# Altium schematic sheet SD & Boot.SchDoc
size A3; SheetNumber: 4; SheetTotal: 11
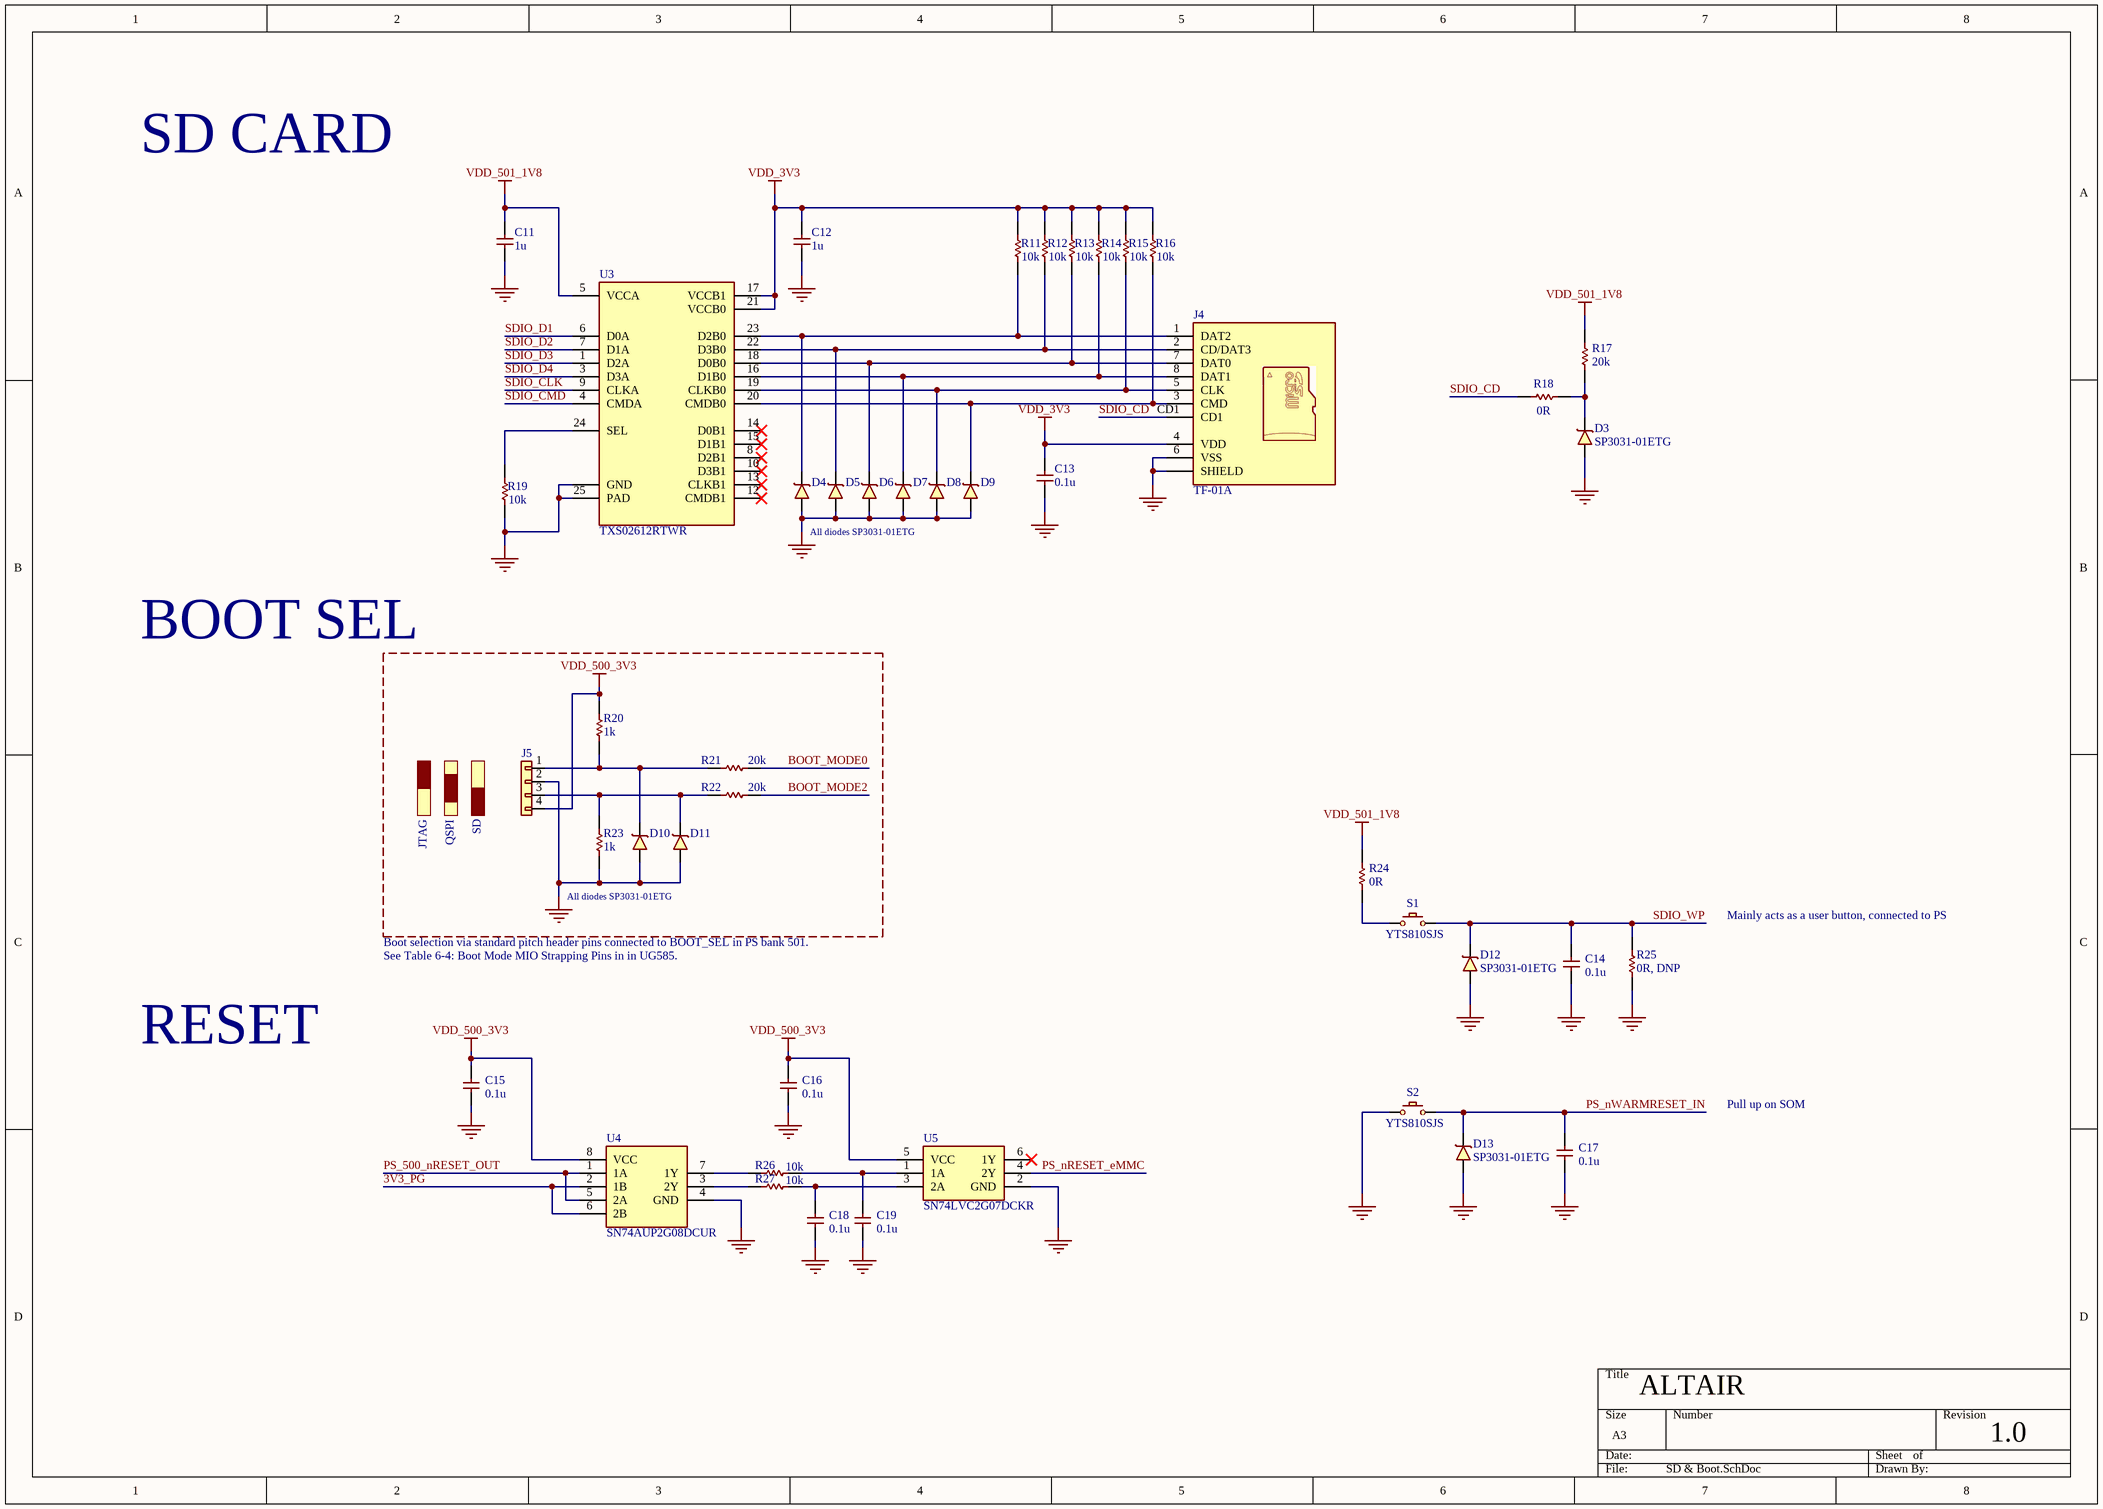
[diagram p0: SD & Boot.SchDoc]

## Parts
C11  1u  [CAP_0402]
C12  1u  [CAP_0402]
C13  0.1u  [CAP_0402]
C14  0.1u  [CAP_0402]
C15  0.1u  [CAP_0402]
C16  0.1u  [CAP_0402]
C17  0.1u  [CAP_0402]
C18  0.1u  [CAP_0402]
C19  0.1u  [CAP_0402]
D3  SP3031-01ETG  [SP303101ETG]
D4  SP3031-01ETG  [SP303101ETG]  (value not drawn)
D5  SP3031-01ETG  [SP303101ETG]  (value not drawn)
D6  SP3031-01ETG  [SP303101ETG]  (value not drawn)
D7  SP3031-01ETG  [SP303101ETG]  (value not drawn)
D8  SP3031-01ETG  [SP303101ETG]  (value not drawn)
D9  SP3031-01ETG  [SP303101ETG]  (value not drawn)
D10  SP3031-01ETG  [SP303101ETG]  (value not drawn)
D11  SP3031-01ETG  [SP303101ETG]  (value not drawn)
D12  SP3031-01ETG  [SP303101ETG]
D13  SP3031-01ETG  [SP303101ETG]
J4  TF-01A  [TF01A]
J5  4xHeader  [HDRV4W95P0X254_1X4_1016X254X854P]  (value not drawn)
R11  10k  [RES_0402]
R12  10k  [RES_0402]
R13  10k  [RES_0402]
R14  10k  [RES_0402]
R15  10k  [RES_0402]
R16  10k  [RES_0402]
R17  20k  [RES_0402]
R18  0R  [RES_0402]
R19  10k  [RES_0402]
R20  1k  [RES_0402]
R21  20k  [RES_0402]
R22  20k  [RES_0402]
R23  1k  [RES_0402]
R24  0R  [RES_0402]
R25  0R, DNP  [RES_0402]
R26  10k  [RES_0402]
R27  10k  [RES_0402]
S1  YTS810SJS  [YTS810SJS]
S2  YTS810SJS  [YTS810SJS]
U3  TXS02612RTWR  [QFN50P400X400X80-25N-D]
U4  SN74AUP2G08DCUR  [SOP50P310X90-8N]
U5  SN74LVC2G07DCKR  [SOT65P210X110-6N]

## Nets
GND: C11.1 C12.1 C13.1 C14.1 C15.1 C16.1 C17.1 C18.1 C19.1 D3.2(A) D4.2(A) D5.2(A) D6.2(A) D7.2(A) D8.2(A) D9.2(A) D10.2(A) D11.2(A) D12.2(A) D13.2(A) J4.6(VSS) J4.SHLD(SHIELD) J5.2 R19.2 R23.2 R25.2 S2.1 U3.25(PAD) U3.GND U4.4(GND) U5.2(GND)
VDD_3V3: C12.2 C13.2 J4.4(VDD) R11.1 R12.1 R13.1 R14.1 R15.1 R16.1 U3.17(VCCB1) U3.21(VCCB0)
VDD_500_3V3: C15.2 C16.2 J5.4 R20.1 U4.8(VCC) U5.5(VCC)
VDD_501_1V8: C11.2 R17.1 R24.1 U3.5(VCCA)
3V3_PG: U4.2(1B) U4.6(2B)
BOOT_MODE0: R21.2
BOOT_MODE2: R22.2
PS_500_nRESET_OUT: U4.1(1A) U4.5(2A)
PS_nRESET_eMMC: U5.4(2Y)
PS_nWARMRESET_IN: C17.2 D13.1(K) S2.2
SDIO_CD: J4.CD1 R18.1
SDIO_CLK: U3.9(CLKA)
SDIO_CMD: U3.4(CMDA)
SDIO_D1: U3.6(D0A)
SDIO_D2: U3.7(D1A)
SDIO_D3: U3.1(D2A)
SDIO_D4: U3.3(D3A)
SDIO_WP: C14.2 D12.1(K) R25.1 S1.2
NetC18_2: C18.2 R27.2 U5.3(2A)
NetC19_2: C19.2 R26.2 U5.1(1A)
NetD3_1: D3.1(K) R17.2 R18.2
NetD4_1: D4.1(K) J4.1(DAT2) R11.2 U3.23(D2B0)
NetD5_1: D5.1(K) J4.2(CD/DAT3) R12.2 U3.22(D3B0)
NetD6_1: D6.1(K) J4.7(DAT0) R13.2 U3.18(D0B0)
NetD7_1: D7.1(K) J4.8(DAT1) R14.2 U3.16(D1B0)
NetD8_1: D8.1(K) J4.5(CLK) R15.2 U3.19(CLKB0)
NetD9_1: D9.1(K) J4.3(CMD) R16.2 U3.20(CMDB0)
NetD10_1: D10.1(K) J5.1 R20.2 R21.1
NetD11_1: D11.1(K) J5.3 R22.1 R23.1
NetR19_1: R19.1 U3.24(SEL)
NetR24_2: R24.2 S1.1
NetR26_1: R26.1 U4.7(1Y)
NetR27_1: R27.1 U4.3(2Y)

Not connected (* = marked no-connect by the designer): U3 8(D2B1)* 10(D3B1)* 12(CMDB1)* 13(CLKB1)* 14(D0B1)* 15(D1B1)*; U5 6(1Y)*

## Notes on the sheet
- SD CARD
- All diodes SP3031-01ETG
- BOOT SEL
- JTAG
- QSPI
- (near J5) SD
- Mainly acts as a user button, connected to PS
- Boot selection via standard pitch header pins connected to BOOT_SEL in PS bank 501.
- See Table 6-4: Boot Mode MIO Strapping Pins in in UG585.
- RESET
- Pull up on SOM
- ALTAIR
- 1.0

## Library data of the parts
C11 C12 = CAP_0402: Capacitor SMD 0402; Part No: CL05A105KP5NNNC; Note/Misc: 10V; LCSC: *; JLCPCB Part #: C14445; Footprint JLCPCB: 0402
C13-C19 = CAP_0402: Capacitor SMD 0402; Part No: CL05B104KO5NNNC; Note/Misc: 16V, 0402; LCSC: *; JLCPCB Part #: C338112; Footprint JLCPCB: 0402
D3-D13 = SP3031-01ETG: TVS Diode (Uni-directional); Footprint JLCPCB: SOD-882; JLCPCB Part #: C207283; LCSC: *; Note/Misc: *; Part No: SP3031-01ETG
J4 = TF-01A: SD CARD Connector Slot; LCSC: *; Note/Misc: *; Part No: TF-01A; JLCPCB Part #: C91145; Footprint JLCPCB: SMD
J5 = 4xHeader: Standard 4 pin 2.54mm pitch connector; Part No: X6511WV-04H-C60D30; Footprint JLCPCB: Plugin,P=2.54mm; JLCPCB Part #: C706876
R11-R16 R19 R26 R27 = RES_0402: Resistor SMD 0402; Part No: RC0402JR-0710KL; LCSC: *; JLCPCB Part #: C60489; Footprint JLCPCB: 0402
R17 R21 R22 = RES_0402: Resistor SMD 0402; Part No: RC0402FR-0720KL; LCSC: *; JLCPCB Part #: C93942; Footprint JLCPCB: 0402
R18 R24 R25 = RES_0402: Resistor SMD 0402; Part No: RC0402JR-070RL; LCSC: *; JLCPCB Part #: C60485; Footprint JLCPCB: 0402
  R25: Note/Misc: DNP
R20 R23 = RES_0402: Resistor SMD 0402; Part No: RC0402JR-071KL; LCSC: *; JLCPCB Part #: C105637; Footprint JLCPCB: 0402
S1 S2 = YTS810SJS: Button SMD 4-Pin; Footprint JLCPCB: SMD; JLCPCB Part #: C2910646; Part No: YTS810SJS
U3 = TXS02612RTWR: SD Card Level Shifter Integrated Circuit; LCSC: *; Footprint JLCPCB: WQFN-24-EP(4x4); JLCPCB Part #: C140276; Note/Misc: *; Part No: TXS02612RTWR
U4 = SN74AUP2G08DCUR: AND Gate 2 inputs 2 outputs Integrated Circuit; Footprint JLCPCB: VSSOP-8-0.5mm; JLCPCB Part #: C544478; Part No: SN74AUP2G08DCUR
U5 = SN74LVC2G07DCKR: Buffer Gate 1 input 1 output; Footprint JLCPCB: SC-70-6; JLCPCB Part #: C7849; Part No: SN74LVC2G07DCKR